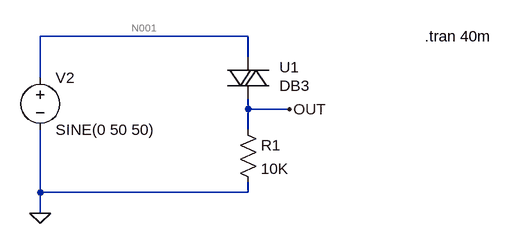
[diagram p0: schematic DIAC_30V.asc]
DIAC_30V.asc, the LTspice schematic file:
Version 4.1
SHEET 1 880 680
WIRE -432 64 -752 64
WIRE -432 96 -432 64
WIRE -752 128 -752 64
WIRE -432 176 -432 160
WIRE -368 176 -432 176
WIRE -432 208 -432 176
WIRE -752 304 -752 208
WIRE -432 304 -432 288
WIRE -432 304 -752 304
WIRE -752 336 -752 304
FLAG -752 336 0
FLAG -368 176 OUT
SYMBOL voltage -752 112 R0
WINDOW 123 0 0 Left 0
WINDOW 39 0 0 Left 0
SYMATTR InstName V2
SYMATTR Value SINE(0 50 50)
SYMBOL res -448 192 R0
SYMATTR InstName R1
SYMATTR Value 10K
SYMBOL MyLib\\DIAC\\Alexander_DB3 -464 96 R0
WINDOW 38 80 44 Left 2
SYMATTR InstName U1
TEXT -160 64 Left 2 !.tran 40m

The netlist it stands for:
* DIAC_30V.asc
V2 N001 0 SINE(0 50 50)
R1 OUT 0 10K
X§U1 N001 OUT DB3  ; pins + -
.tran 40m
.lib MyLib/DIAC/Alexander_DB3.lib
.backanno
.end

* Results of the author's LTspice run, read from the files saved beside the schematic
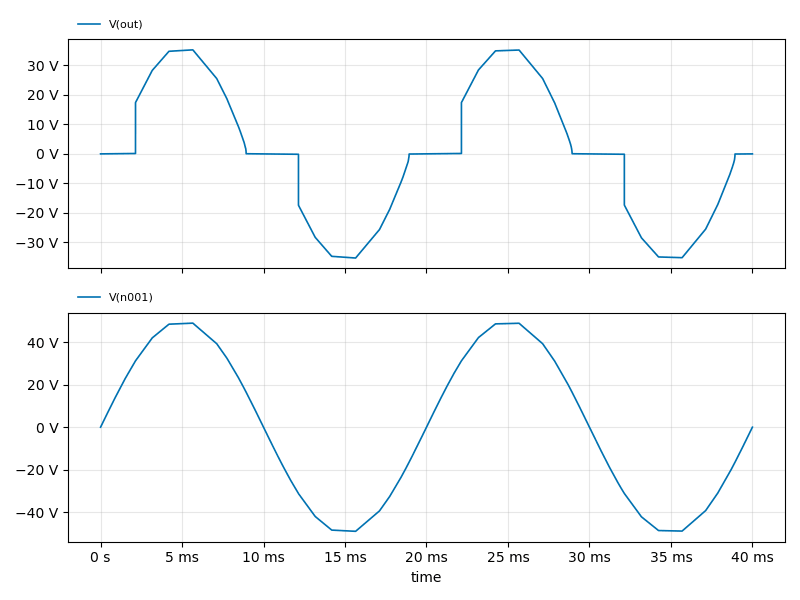
[diagram p1: Transient Analysis of DIAC_30V.asc, plotted from the saved traces]
* Transient Analysis, 1 run:
*   V(out): min -35.34 V, max 35.3 V, average -1.263 mV, rms 22.98 V, last 167.3 µV
*   V(n001): min -48.94 V, max 48.91 V, average -1.708 mV, rms 35.04 V, last 0 V